# Altium schematic sheet [05] - FPGA - USB HOST.SchDoc
size A3; SheetNumber: 5; SheetTotal: 5
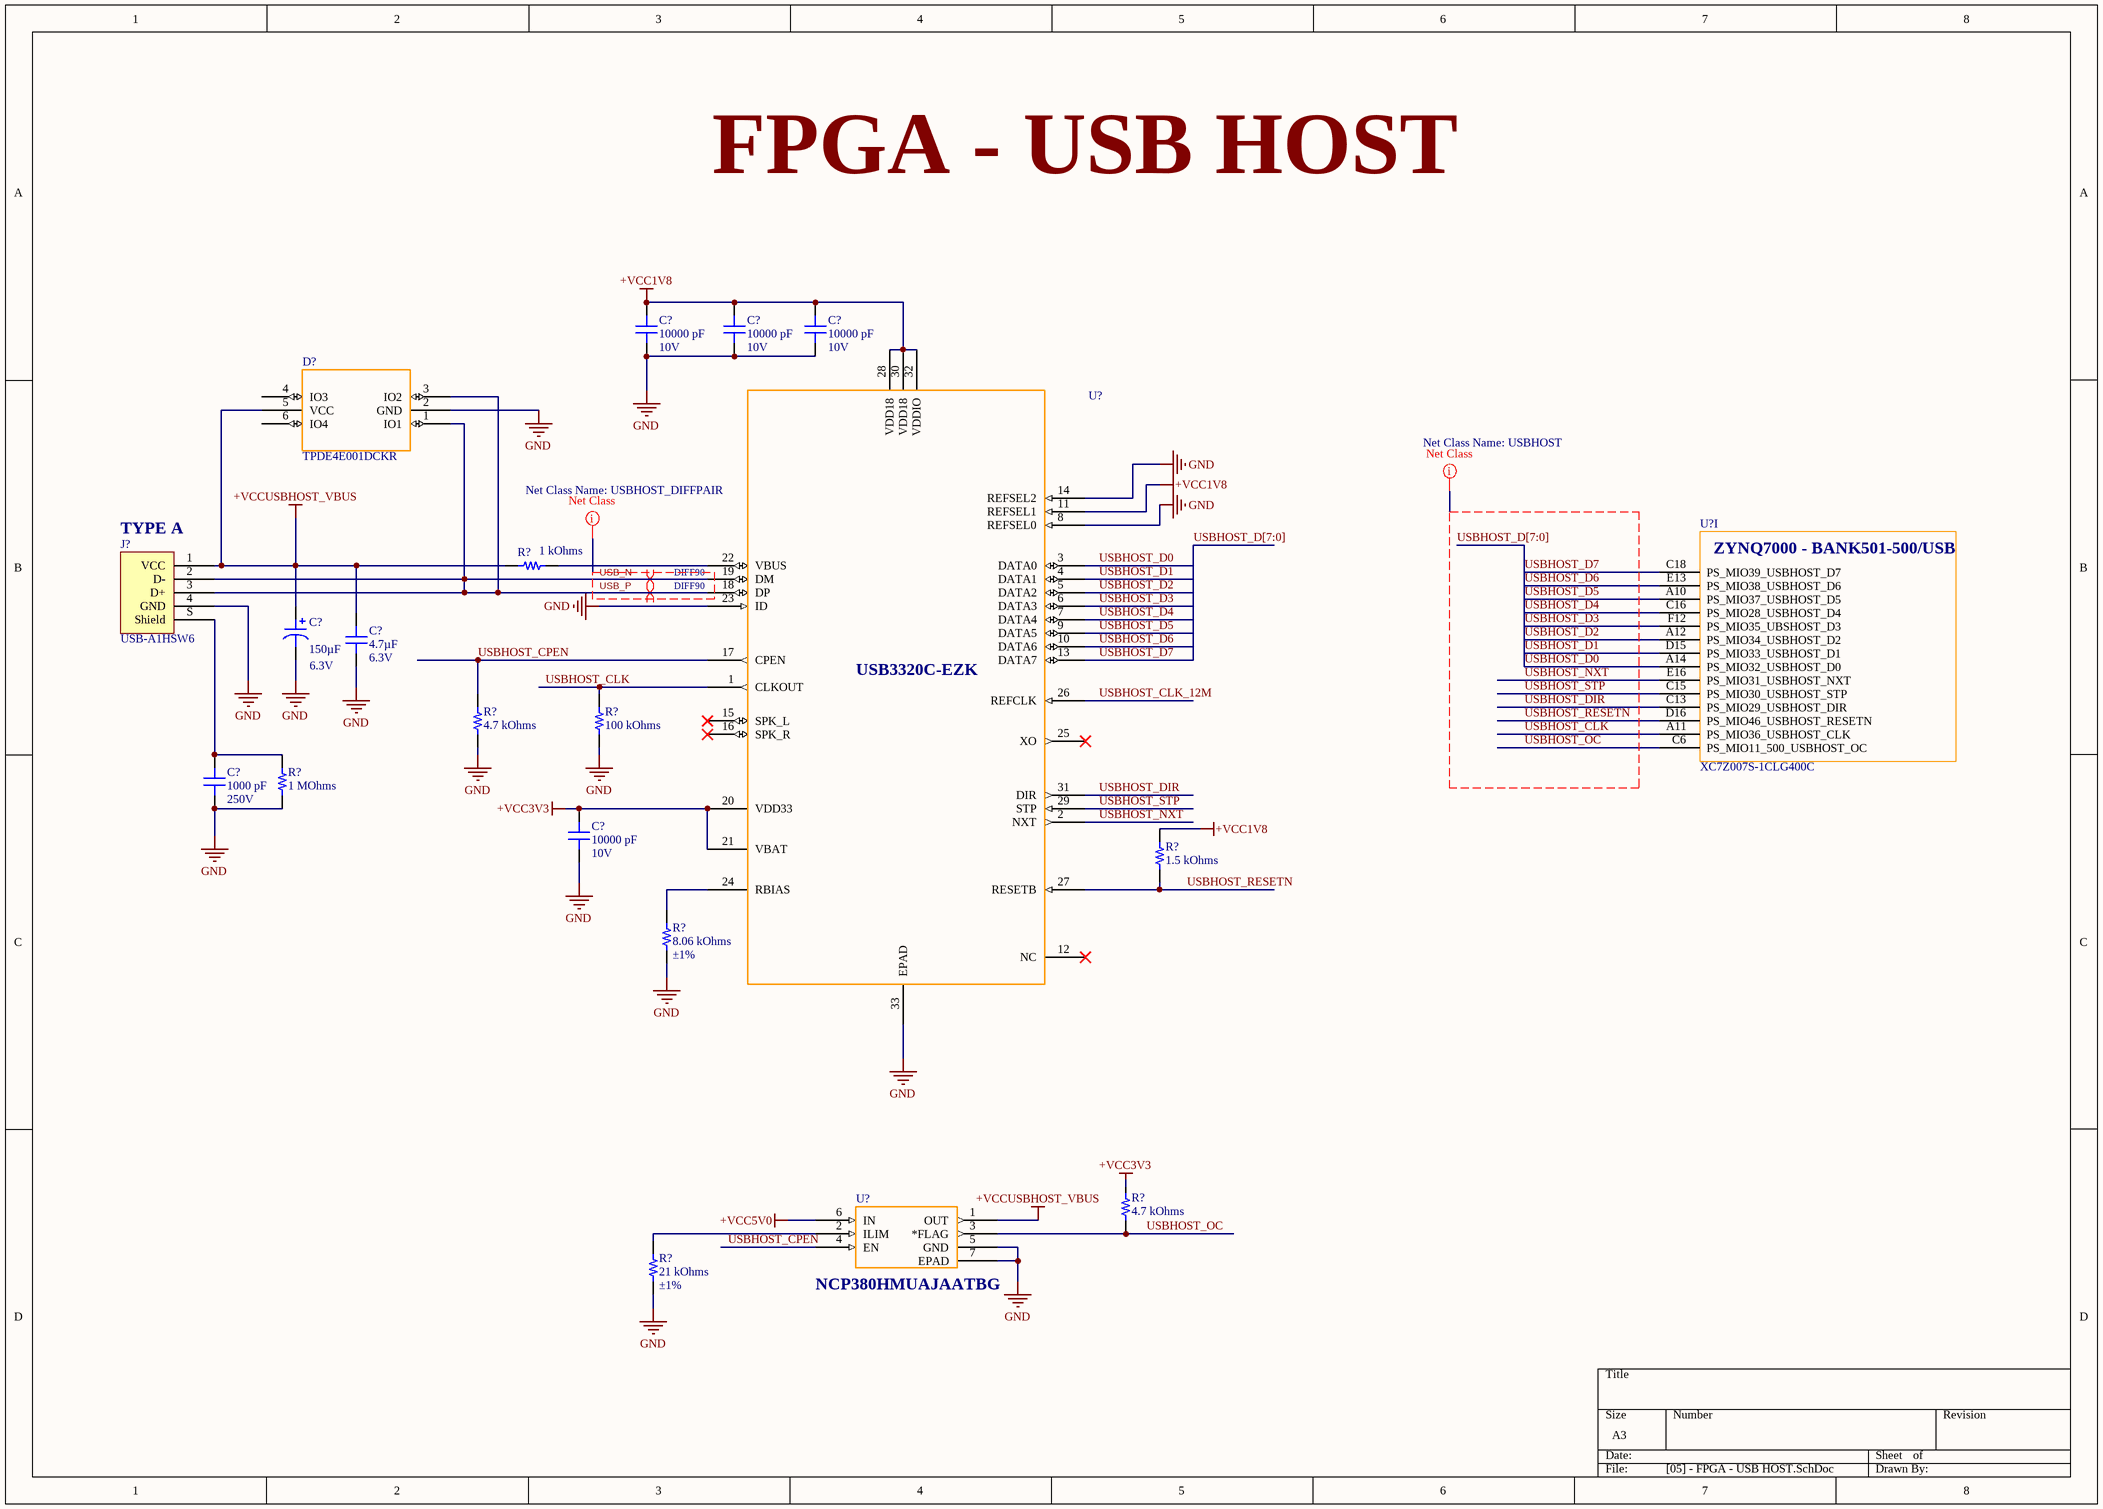
[diagram p0: [05] - FPGA - USB HOST.SchDoc]

## Parts
(Parts that share a designator on the sheet are numbered #1, #2 ... from top to bottom, then left to right.)
C?#1  Voltage - Rated: 10V  [CAP 0201_0603]  (hidden comment: 10000 pF)
C?#2  Voltage - Rated: 10V  [CAP 0201_0603]  (hidden comment: 10000 pF)
C?#3  Voltage - Rated: 10V  [CAP 0201_0603]  (hidden comment: 10000 pF)
C?#4  Voltage - Rated: 6.3V  [CAP POL 1411_3528]  (hidden comment: 150µF)
C?#5  Voltage - Rated: 6.3V  [CAP 0603_1608]  (hidden comment: 4.7µF)
C?#6  Voltage - Rated: 250V  [CAP 0805_2012]  (hidden comment: 1000 pF)
C?#7  Voltage - Rated: 10V  [CAP 0201_0603]  (hidden comment: 10000 pF)
D?  TPDE4E001DCKR  [TPDE4E001DCKR]
J?  USB-A1HSW6  [ON SHORE TECHNOLOGY USB-A1HSW6]
R?#1  1 kOhms  [RES 0201_0603]
R?#2  Resistance: 4.7 kOhms  [RES 0201_0603]  (hidden comment: RC0603J472CS)
R?#3  100 kOhms  [RES 0201_0603]
R?#4  1 MOhms  [RES 0402_1005]
R?#5  1.5 kOhms  [RES 0201_0603]
R?#6  Tolerance: ±1%  [RES 0201_0603]  (hidden comment: 8.06 kOhms)
R?#7  Resistance: 4.7 kOhms  [RES 0201_0603]  (hidden comment: RC0603J472CS)
R?#8  Tolerance: ±1%  [RES 0201_0603]  (hidden comment: 21 kOhms)
U?#1  USB3320C-EZK  [USB3320C-EZK]  (value not drawn)
U?#2  XC7Z007S-1CLG400C  [CLG400_XIL]  (part I of 9)
U?#3  NCP380HMUAJAATBG  [NCP380HMUAJAATBG]

## Nets
+VCC1V8: C?#1.2 C?#2.2 C?#3.2 R?#5.1 U?#1.11(REFSEL1) U?#1.28(VDD18) U?#1.30(VDD18) U?#1.32(VDDIO)
+VCC3V3: C?#7.2 R?#7.2 U?#1.20(VDD33) U?#1.21(VBAT)
+VCC5V0: U?#3.6(IN)
+VCCUSBHOST_VBUS: C?#4.1 C?#5.1 D?.5(VCC) J?.1(VCC) R?#1.2 U?#3.1(OUT)
GND: C?#1.1 C?#2.1 C?#3.1 C?#4.2 C?#5.2 C?#6.1 C?#7.1 D?.2(GND) J?.4(GND) R?#2.1 R?#3.1 R?#4.1 R?#6.1 R?#8.1 U?#1.8(REFSEL0) U?#1.14(REFSEL2) U?#1.23(ID) U?#1.33(EPAD) U?#3.5(GND) U?#3.7(EPAD)
USB_N: D?.1(IO1) D?.3(IO2) J?.2(D-) J?.3(D+) U?#1.18(DP) U?#1.19(DM)  [also labelled USB_P]
USBHOST_CLK: R?#3.2 U?#1.1(CLKOUT) U?#2.A11(PS_MIO36_USBHOST_CLK)
USBHOST_CLK_12M: U?#1.26(REFCLK)
USBHOST_CPEN: R?#2.2 U?#1.17(CPEN) U?#3.4(EN)
USBHOST_D0: U?#1.3(DATA0) U?#2.A14(PS_MIO32_USBHOST_D0)
USBHOST_D1: U?#1.4(DATA1) U?#2.D15(PS_MIO33_USBHOST_D1)
USBHOST_D2: U?#1.5(DATA2) U?#2.A12(PS_MIO34_USBHOST_D2)
USBHOST_D3: U?#1.6(DATA3) U?#2.F12(PS_MIO35_UBSHOST_D3)
USBHOST_D4: U?#1.7(DATA4) U?#2.C16(PS_MIO28_USBHOST_D4)
USBHOST_D5: U?#1.9(DATA5) U?#2.A10(PS_MIO37_USBHOST_D5)
USBHOST_D6: U?#1.10(DATA6) U?#2.E13(PS_MIO38_USBHOST_D6)
USBHOST_D7: U?#1.13(DATA7) U?#2.C18(PS_MIO39_USBHOST_D7)
USBHOST_DIR: U?#1.31(DIR) U?#2.C13(PS_MIO29_USBHOST_DIR)
USBHOST_NXT: U?#1.2(NXT) U?#2.E16(PS_MIO31_USBHOST_NXT)
USBHOST_OC: R?#7.1 U?#2.C6(PS_MIO11_500_USBHOST_OC) U?#3.3(*FLAG)
USBHOST_RESETN: R?#5.2 U?#1.27(RESETB) U?#2.D16(PS_MIO46_USBHOST_RESETN)
USBHOST_STP: U?#1.29(STP) U?#2.C15(PS_MIO30_USBHOST_STP)
NetC?#6_2: C?#6.2 J?.S(Shield) R?#4.2
NetR?#1_1: R?#1.1 U?#1.22(VBUS)
NetR?#6_2: R?#6.2 U?#1.24(RBIAS)
NetR?#8_2: R?#8.2 U?#3.2(ILIM)

Not connected (* = marked no-connect by the designer): D? 4(IO3) 6(IO4); U?#1 12(NC)* 15(SPK_L)* 16(SPK_R)* 25(XO)*

## Buses and harness runs
bus USBHOST_D[7:0]

## Layout directives
differential pair; net class DIFF90: USB_N
Net Class Name: USBHOST: (no net found under the mark)
Net Class Name: USBHOST_DIFFPAIR: (no net found under the mark)

## Notes on the sheet
- FPGA - USB HOST
- (near J?) TYPE A
- (near U?#1) USB3320C-EZK
- (in symbol XC7Z007S-1CLG400C, part I) ZYNQ7000 - BANK501-500/USB

## Library data of the parts
C?#1-C?#3 C?#7 = MAASL063SB7103MFCA01: CAP CER 0.01UF 10V X7R 0201; manufacturer: Taiyo Yuden; Tolerance: ±20%; Part Number: MAASL063SB7103MFCA01; Value: 10000 pF; Applications: Automotive; Capacitance: 10000 pF; componentlink1description: Datasheet; componentlink1url: https://media.digikey.com/pdf/Data%20Sheets/Taiyo%20Yuden%20PDFs%20URL%20links/MAASL063SB7103MFCA01_SS.pdf; componentlink2description: DigiKey Link; componentlink2url: https://www.digikey.com/en/products/detail/taiyo-yuden/MAASL063SB7103MFCA01/18109005; Device Package: 0201 (0603 Metric); Height - Seated (Max): 0.013" (0.33mm); lastupdated: 27.04.2023 19:00:59; Lifecycle Status: Active; Minimum Order: 1; Mounting Type: Surface Mount, MLCC; Operating Temperature: -55°C ~ 125°C; Package / Case: 0201 (0603 Metric); packaging: TapeAndReel; partid: 47946; Part Status: Active; price: 0.01; Ratings: AEC-Q200; series: MAAS; Size / Dimension: 0.024" L x 0.012" W (0.60mm x 0.30mm); Supplier 1: DigiKey; Supplier Part Number 1: 587-MAASL063SB7103MFCA01CT-ND; Temperature Coefficient: X7R; Thickness (Max): 0.013" (0.33mm)
C?#4 = TLJH157M006R0900: CAP TANT 150UF 20% 6.3V 1411; manufacturer: AVX Corporation; Manufacturer Size Code: H; ESR (Equivalent Series Resistance): 900mOhm; Type: Molded; Part Number: TLJH157M006R0900; Value: 150µF; Capacitance: 150µF; componentlink1description: Datasheet; componentlink1url: http://datasheets.avx.com/TLJ.pdf; componentlink2description: DigiKey Link; componentlink2url: http://digikey.com/product-detail/en/avx-corporation/TLJH157M006R0900/478-5347-1-ND/1957565; Features: General Purpose; Height - Seated (Max): 0.059" (1.50mm); lastupdated: 2.09.2020 01:15:46; Lifecycle Status: Active; Minimum Order: 1; Mounting Type: Surface Mount; Operating Temperature: -55°C ~ 125°C; Package / Case: 1411 (3528 Metric), 1210; packaging: TapeAndReel; partid: 14; Part Status: Active; price: 0.52; series: TLJ; Size / Dimension: 0.138" L x 0.110" W (3.50mm x 2.80mm); Supplier 1: DigiKey; Supplier Part Number 1: 478-5347-1-ND; Tolerance: ±20%
C?#5 = 06036D475KAT4A: CAP CER 4.7UF 6.3V X5R 0603; manufacturer: AVX Corporation; Tolerance: ±10%; Part Number: 06036D475KAT4A; Value: 4.7µF; Applications: General Purpose; Capacitance: 4.7µF; componentlink1description: Datasheet; componentlink1url: http://datasheets.avx.com/cx5r.pdf; componentlink2description: DigiKey Link; componentlink2url: http://digikey.com/product-detail/en/avx-corporation/06036D475KAT4A/478-10813-1-ND/7536337; Device Package: 0603 (1608 Metric); lastupdated: 2.09.2020 01:03:34; Lifecycle Status: Active; Minimum Order: 1; Mounting Type: Surface Mount, MLCC; Operating Temperature: -55°C ~ 85°C; Package / Case: 0603 (1608 Metric); packaging: TapeAndReel; partid: 2929; Part Status: Active; price: 0.02; series: -; Size / Dimension: 0.063" L x 0.032" W (1.60mm x 0.81mm); Supplier 1: DigiKey; Supplier Part Number 1: 478-10813-1-ND; Temperature Coefficient: X5R; Thickness (Max): 0.037" (0.94mm)
C?#6 = C0805C102FAGECAUTO: CAP CER 0805 1NF 250V C0G 1%; manufacturer: KEMET; Temperature Coefficient: C0G, NP0; Part Number: C0805C102FAGECAUTO; Value: 1000 pF; Applications: Automotive, ESD Protection; Capacitance: 1000 pF; componentlink1description: Datasheet; componentlink1url: https://connect.kemet.com:7667/gateway/IntelliData-ComponentDocumentation/1.0/download/datasheet/C0805C102FAGECAUTO; componentlink2description: DigiKey Link; componentlink2url: https://www.digikey.com/en/products/detail/kemet/C0805C102FAGECAUTO/8647301; Device Package: 0805 (2012 Metric); Features: Low ESL; lastupdated: 2.05.2023 19:12:16; Lifecycle Status: Active; Minimum Order: 1; Mounting Type: Surface Mount, MLCC; Operating Temperature: -55°C ~ 125°C; Package / Case: 0805 (2012 Metric); packaging: TapeAndReel; partid: 49020; Part Status: Active; price: 0.32; Ratings: AEC-Q200; series: ESD SMD Auto C0G; Size / Dimension: 0.079" L x 0.049" W (2.00mm x 1.25mm); Supplier 1: DigiKey; Supplier Part Number 1: 399-C0805C102FAGECAUTOCT-ND; Thickness (Max): 0.039" (1.00mm); Tolerance: ±1%
J? = USB-A1HSW6: CONN RCPT TYPEA 4POS R/A; Manufacturer: On Shore Technology Inc.; Connector Type: USB - A; Current Rating (Amps): 1A; Gender: Receptacle; Number of Contacts: 4; Number of Ports: 1; Shielding: Unshielded; Voltage - Rated: 30VAC; Part Number: USB-A1HSW6; ComponentLink1Description: Datasheet; ComponentLink1URL: http://www.on-shore.com/wp-content/uploads/USB-A1HSXX.pdf; ComponentLink2Description: DigiKey Link; ComponentLink2URL: http://digikey.com/product-detail/en/on-shore-technology-inc/USB-A1HSW6/ED2989-ND/2677750; Features: Board Lock; LastUpdated: 30.04.2020 11:56:44; Lifecycle Status: Active; Minimum Order: 1; Mounting Feature: Horizontal; Mounting Type: Through Hole, Right Angle; Operating Temperature: 0°C ~ 85°C; Packaging: Tray; Part Status: Active; Price: 0.48; Series: -; Supplier 1: DigiKey; Supplier Part Number 1: ED2989-ND; Termination: Solder
R?#1 = RMCF0201JT1K00: RES 1K OHM 5% 1/20W 0201; Manufacturer: Stackpole Electronics Inc; Power (Watts): 0.05W, 1/20W; Temperature Coefficient: ±200ppm/°C; Part Number: RMCF0201JT1K00; Value: 1 kOhms; ComponentLink1Description: Datasheet; ComponentLink1URL: https://www.seielect.com/catalog/sei-rmcf_rmcp.pdf; ComponentLink2Description: DigiKey Link; ComponentLink2URL: https://www.digikey.com/en/products/detail/stackpole-electronics-inc/RMCF0201JT1K00/1714962; Composition: Thick Film; Device Package: 0201 (0603 Metric); Height - Seated (Max): 0.011" (0.28mm); LastUpdated: 2.05.2023 19:18:53; Lifecycle Status: Active; Minimum Order: 1; Number of Terminations: 2; Operating Temperature: -55°C ~ 155°C; Package / Case: 0201 (0603 Metric); Packaging: CutTape; PartId: 791; Part Status: Active; Price: 0.01; Ratings: AEC-Q200; Resistance: 1 kOhms; Series: RMCF; Size / Dimension: 0.024" L x 0.012" W (0.60mm x 0.30mm); Supplier 1: DigiKey; Supplier Part Number 1: 738-RMCF0201JT1K00CT-ND; Supplier Device Package: 0201; Tolerance: ±5%
R?#2 R?#7 = RC0603J472CS: RES SMD 4.7K OHM 5% 1/20W 0201; Manufacturer: Samsung Electro-Mechanics; Power (Watts): 0.05W, 1/20W; Temperature Coefficient: ±250ppm/°C; Part Number: RC0603J472CS; ComponentLink1Description: Datasheet; ComponentLink1URL: http://www.samsungsem.com/kr/support/product-search/chip-resistor/__icsFiles/afieldfile/2019/01/21/RC_Spec_Sheet(1901).pdf; ComponentLink2Description: DigiKey Link; ComponentLink2URL: https://www.digikey.com/en/products/detail/samsung-electro-mechanics/RC0603J472CS/3964117; Composition: Thick Film; Device Package: 0201 (0603 Metric); Features: Moisture Resistant; Height - Seated (Max): 0.010" (0.26mm); LastUpdated: 2.05.2023 19:18:28; Lifecycle Status: Active; Minimum Order: 15000; Number of Terminations: 2; Operating Temperature: -55°C ~ 125°C; Package / Case: 0201 (0603 Metric); PartId: 66832; Part Status: Active; Price: 0; Series: RC; Size / Dimension: 0.024" L x 0.012" W (0.60mm x 0.30mm); Supplier 1: DigiKey; Supplier Part Number 1: 1276-3810-1-ND; Supplier Device Package: 0201; Tolerance: ±5%
R?#3 = RMCF0201JT100K: RES 100K OHM 5% 1/20W 0201; Manufacturer: Stackpole Electronics Inc; Power (Watts): 0.05W, 1/20W; Temperature Coefficient: ±200ppm/°C; Part Number: RMCF0201JT100K; Value: 100 kOhms; ComponentLink1Description: Datasheet; ComponentLink1URL: https://www.seielect.com/catalog/sei-rmcf_rmcp.pdf; ComponentLink2Description: DigiKey Link; ComponentLink2URL: https://www.digikey.com/en/products/detail/stackpole-electronics-inc/RMCF0201JT100K/1714959; Composition: Thick Film; Device Package: 0201 (0603 Metric); Height - Seated (Max): 0.011" (0.28mm); LastUpdated: 2.05.2023 19:18:53; Lifecycle Status: Active; Minimum Order: 1; Number of Terminations: 2; Operating Temperature: -55°C ~ 155°C; Package / Case: 0201 (0603 Metric); Packaging: CutTape; PartId: 808; Part Status: Active; Price: 0.01; Ratings: AEC-Q200; Resistance: 100 kOhms; Series: RMCF; Size / Dimension: 0.024" L x 0.012" W (0.60mm x 0.30mm); Supplier 1: DigiKey; Supplier Part Number 1: RMCF0201JT100KCT-ND; Supplier Device Package: 0201; Tolerance: ±5%
R?#4 = RK73H1ETTP1004D: RES 1M OHM 0.5% 1/10W 0402; Manufacturer: KOA Speer Electronics, Inc.; Power (Watts): 0.1W, 1/10W; Temperature Coefficient: ±100ppm/°C; Part Number: RK73H1ETTP1004D; Value: 1 MOhms; ComponentLink1Description: Datasheet; ComponentLink1URL: https://www.koaspeer.com/pdfs/RK73H.pdf; ComponentLink2Description: DigiKey Link; ComponentLink2URL: https://www.digikey.com/en/products/detail/koa-speer-electronics-inc/RK73H1ETTP1004D/9853534; Composition: Thick Film; Device Package: 0402 (1005 Metric); Features: Automotive AEC-Q200, Moisture Resistant; Height - Seated (Max): 0.016" (0.40mm); LastUpdated: 2.05.2023 19:23:50; Lifecycle Status: Active; Minimum Order: 1000; Number of Terminations: 2; Operating Temperature: -55°C ~ 155°C; Package / Case: 0402 (1005 Metric); Packaging: TapeAndReel; PartId: 70036; Part Status: Active; Price: 0.03; Ratings: AEC-Q200; Resistance: 1 MOhms; Series: RK73H; Size / Dimension: 0.039" L x 0.020" W (1.00mm x 0.50mm); Supplier 1: DigiKey; Supplier Part Number 1: 2019-RK73H1ETTP1004DCT-ND; Supplier Device Package: 0402; Tolerance: ±0.5%
R?#5 = CRCW02011K50JNED: RES SMD 1.5K OHM 5% 1/20W 0201; Manufacturer: Vishay Dale; Power (Watts): 0.05W, 1/20W; Temperature Coefficient: ±200ppm/°C; Part Number: CRCW02011K50JNED; Value: 1.5 kOhms; ComponentLink1Description: Datasheet; ComponentLink1URL: http://www.vishay.com/docs/20052/crcw0201e3.pdf; ComponentLink2Description: DigiKey Link; ComponentLink2URL: http://digikey.com/product-detail/en/vishay-dale/CRCW02011K50JNED/541-CRCW02011K50JNEDCT-ND/10449419; Composition: Thick Film; Device Package: 0201 (0603 Metric); Height - Seated (Max): 0.011" (0.28mm); LastUpdated: 2.05.2023 19:18:55; Lifecycle Status: Active; Minimum Order: 1; Number of Terminations: 2; Operating Temperature: -55°C ~ 155°C; Package / Case: 0201 (0603 Metric); Packaging: CutTape; PartId: 491; Part Status: Active; Price: 0.10; Resistance: 1.5 kOhms; Series: CRCW; Size / Dimension: 0.024" L x 0.012" W (0.60mm x 0.30mm); Supplier 1: DigiKey; Supplier Part Number 1: 541-CRCW02011K50JNEDCT-ND; Supplier Device Package: 0201; Tolerance: ±5%
R?#6 = AC0201FR-078K06L: RES SMD 8.06K OHM 1% 1/20W 0201; Manufacturer: Yageo; Power (Watts): 0.05W, 1/20W; Temperature Coefficient: ±200ppm/°C; Part Number: AC0201FR-078K06L; Value: 8.06 kOhms; ComponentLink1Description: Datasheet; ComponentLink1URL: https://www.yageo.com/upload/media/product/productsearch/datasheet/rchip/PYu-AC_51_RoHS_L_7.pdf; ComponentLink2Description: DigiKey Link; ComponentLink2URL: https://www.digikey.com/en/products/detail/yageo/AC0201FR-078K06L/5894847; Composition: Thick Film; Device Package: 0201 (0603 Metric); Features: Automotive AEC-Q200, Moisture Resistant; Height - Seated (Max): 0.010" (0.26mm); LastUpdated: 2.05.2023 19:18:51; Lifecycle Status: Active; Minimum Order: 1; Number of Terminations: 2; Operating Temperature: -55°C ~ 155°C; Package / Case: 0201 (0603 Metric); Packaging: TapeAndReel; PartId: 994; Part Status: Active; Price: 0.01; Ratings: AEC-Q200; Resistance: 8.06 kOhms; Series: AC; Size / Dimension: 0.024" L x 0.012" W (0.60mm x 0.30mm); Supplier 1: DigiKey; Supplier Part Number 1: YAG5244CT-ND; Supplier Device Package: 0201
R?#8 = RK73H1HTTC2102F: RES 21K OHM 1% 1/20W 0201; Manufacturer: KOA Speer Electronics, Inc.; Power (Watts): 0.05W, 1/20W; Temperature Coefficient: ±200ppm/°C; Part Number: RK73H1HTTC2102F; Value: 21 kOhms; ComponentLink1Description: Datasheet; ComponentLink1URL: https://www.koaspeer.com/pdfs/RK73H.pdf; ComponentLink2Description: DigiKey Link; ComponentLink2URL: https://www.digikey.com/en/products/detail/koa-speer-electronics-inc/RK73H1HTTC2102F/9850277; Composition: Thick Film; Device Package: 0201 (0603 Metric); Features: Automotive AEC-Q200, Moisture Resistant; Height - Seated (Max): 0.010" (0.26mm); LastUpdated: 2.05.2023 19:18:22; Lifecycle Status: Active; Minimum Order: 1; Number of Terminations: 2; Operating Temperature: -55°C ~ 155°C; Package / Case: 0201 (0603 Metric); Packaging: TapeAndReel; PartId: 64518; Part Status: Active; Price: 0.01; Ratings: AEC-Q200; Resistance: 21 kOhms; Series: RK73H; Size / Dimension: 0.024" L x 0.012" W (0.60mm x 0.30mm); Supplier 1: DigiKey; Supplier Part Number 1: 2019-RK73H1HTTC2102FCT-ND; Supplier Device Package: 0201
U?#2 = XC7Z007S-1CLG400C: No Description Available; Mfr_Name: Xilinx Inc; RefDes: RefDes; Type: Type